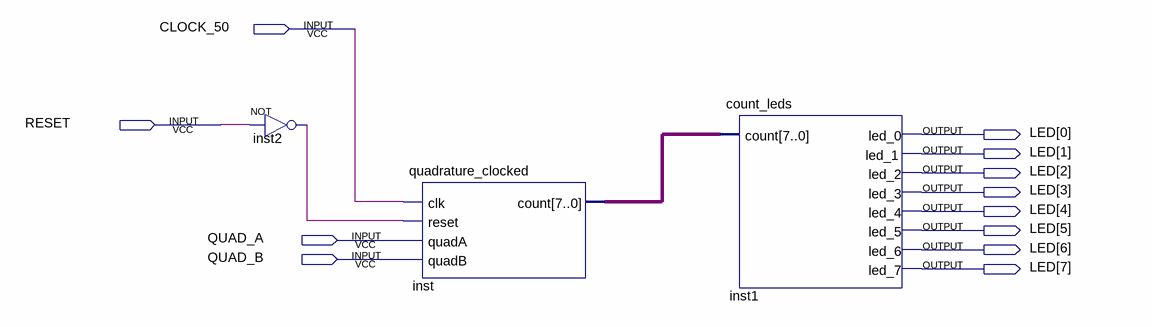
[diagram p0: schematic sheet]
// Quartus schematic rotary_encoder.bdf as structural Verilog: 3 symbols, 12 pins
module rotary_encoder (
  input  CLOCK_50,
  input  RESET,
  input  QUAD_A,
  input  QUAD_B,
  output [7:0] LED
);

  wire inst2_out;
  wire [7:0] inst_count;

  not inst2 (inst2_out, RESET);
  quadrature_clocked inst (.clk(CLOCK_50), .reset(inst2_out), .quadA(QUAD_A), .quadB(QUAD_B), .count(inst_count));
  count_leds inst1 (
    .count(inst_count), .led_0(LED[0]), .led_1(LED[1]), .led_2(LED[2]), .led_3(LED[3]), .led_4(LED[4]),
    .led_5(LED[5]), .led_6(LED[6]), .led_7(LED[7]));
endmodule
